# Altium schematic sheet top_power.SchDoc: Electrical Power System - General Block Diagram - Power
size A4; Date: 2015-08-29; Author: Piotr Kuligowski; Revision: 1-0; SheetTotal: 14; Model: EM1; PageSetup: Record=PageOptions|CenterHorizontal=True|CenterVertical=True|PrintScale=0.52|XCorrection=1.00|YCorrection=1.00|PrintKind=1|BorderSize=5000000|LeftOffset=0|BottomOffset=0|Orientation=2|PaperLength=4200|PaperWidth=2970|Scale=100|PaperSource=7|PrintQuality=600|MediaType=1|DitherType=10|PaperKind=A3|PrintScaleMode=1
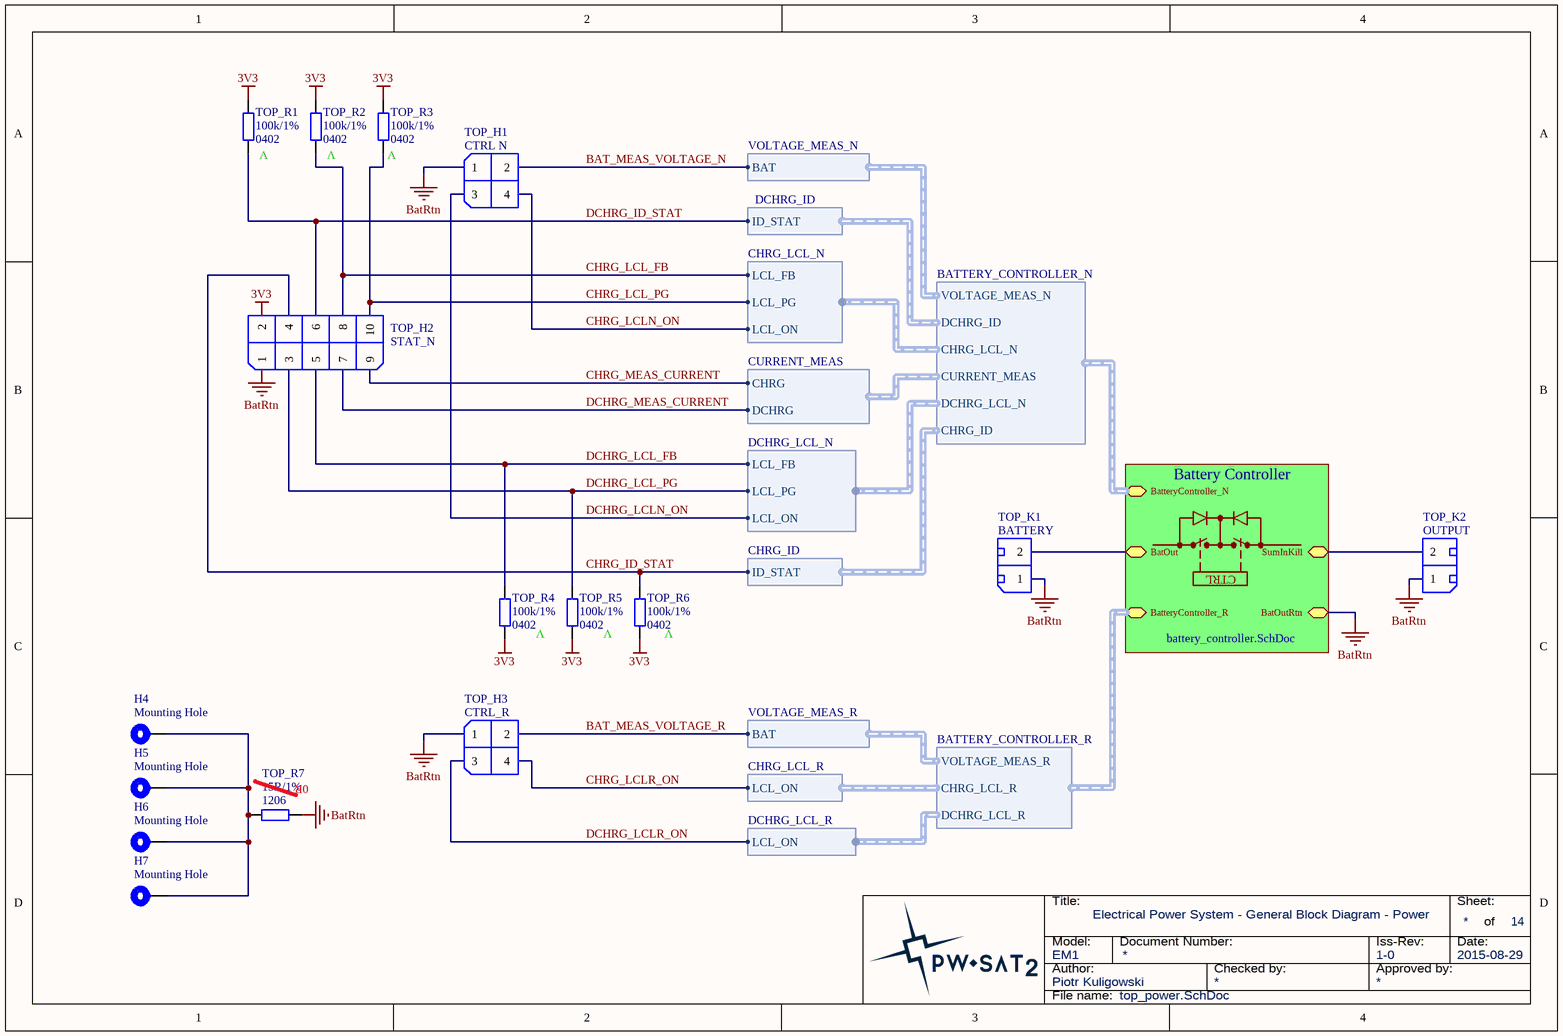
[diagram p0: top_power.SchDoc]

## Parts
H4  Mounting Hole  [PC-104_PcbMntHole_M3]
H5  Mounting Hole  [PC-104_PcbMntHole_M3]
H6  Mounting Hole  [PC-104_PcbMntHole_M3]
H7  Mounting Hole  [PC-104_PcbMntHole_M3]
TOP_H1  CTRL N  [Harwin_Datamate_L-Tek_M80-8670405]
TOP_H2  STAT_N  [Harwin_Datamate_L-Tek_M80-8671005]
TOP_H3  CTRL_R  [Harwin_Datamate_L-Tek_M80-8670405]
TOP_K1  ProviderPartNumber: BATTERY  [TerminalBlock_Spring_2.54_2-R]  (hidden comment: TB-2.5-PD-xx)
TOP_K2  ProviderPartNumber: OUTPUT  [TerminalBlock_Spring_2.54_2-R]  (hidden comment: TB-2.5-PD-xx)
TOP_R1  Package: 0402  [SMD_Resistor_0402]  (hidden comment: 100k/1%)
TOP_R2  Package: 0402  [SMD_Resistor_0402]  (hidden comment: 100k/1%)
TOP_R3  Package: 0402  [SMD_Resistor_0402]  (hidden comment: 100k/1%)
TOP_R4  Package: 0402  [SMD_Resistor_0402]  (hidden comment: 100k/1%)
TOP_R5  Package: 0402  [SMD_Resistor_0402]  (hidden comment: 100k/1%)
TOP_R6  Package: 0402  [SMD_Resistor_0402]  (hidden comment: 100k/1%)
TOP_R7  Package: 1206  [SMD_Resistor_1206]  (hidden comment: 15R/1%)

## Sub-sheets
Battery Controller = battery_controller.SchDoc: SumInKill, BatOut, BatOutRtn, BatteryController_N (harness BATTERY_CONTROLLER_N), BatteryController_R (harness BATTERY_CONTROLLER_R)

## Harnesses
BATTERY_CONTROLLER_N: DCHRG_ID, CHRG_LCL_N, CURRENT_MEAS, DCHRG_LCL_N, CHRG_ID, VOLTAGE_MEAS_N
VOLTAGE_MEAS_N: BAT
DCHRG_ID: ID_STAT
CHRG_LCL_N: LCL_FB, LCL_PG, LCL_ON
CURRENT_MEAS: CHRG, DCHRG
DCHRG_LCL_N: LCL_FB, LCL_PG, LCL_ON
CHRG_ID: ID_STAT
BATTERY_CONTROLLER_R: DCHRG_LCL_R, CHRG_LCL_R, VOLTAGE_MEAS_R
VOLTAGE_MEAS_R: BAT
CHRG_LCL_R: LCL_ON
DCHRG_LCL_R: LCL_ON

## Nets
3V3: TOP_H2.2 TOP_R1.1 TOP_R2.1 TOP_R3.1 TOP_R4.2 TOP_R5.2 TOP_R6.2
BatRtn: TOP_H1.1 TOP_H2.1 TOP_H3.1 TOP_K1.1 TOP_K2.1 TOP_R7.2 ; sheet Battery Controller/BatOutRtn
BAT_MEAS_VOLTAGE_N: TOP_H1.2 ; harness VOLTAGE_MEAS_N.BAT
BAT_MEAS_VOLTAGE_R: TOP_H3.2 ; harness VOLTAGE_MEAS_R.BAT
CHRG_ID_STAT: TOP_H2.4 TOP_R6.1 ; harness CHRG_ID.ID_STAT
CHRG_LCL_FB: TOP_H2.8 TOP_R2.2 ; harness CHRG_LCL_N.LCL_FB
CHRG_LCL_PG: TOP_H2.10 TOP_R3.2 ; harness CHRG_LCL_N.LCL_PG
CHRG_LCLN_ON: TOP_H1.4 ; harness CHRG_LCL_N.LCL_ON
CHRG_LCLR_ON: TOP_H3.4 ; harness CHRG_LCL_R.LCL_ON
CHRG_MEAS_CURRENT: TOP_H2.9 ; harness CURRENT_MEAS.CHRG
DCHRG_ID_STAT: TOP_H2.6 TOP_R1.2 ; harness DCHRG_ID.ID_STAT
DCHRG_LCL_FB: TOP_H2.5 TOP_R4.1 ; harness DCHRG_LCL_N.LCL_FB
DCHRG_LCL_PG: TOP_H2.3 TOP_R5.1 ; harness DCHRG_LCL_N.LCL_PG
DCHRG_LCLN_ON: TOP_H1.3 ; harness DCHRG_LCL_N.LCL_ON
DCHRG_LCLR_ON: TOP_H3.3 ; harness DCHRG_LCL_R.LCL_ON
DCHRG_MEAS_CURRENT: TOP_H2.7 ; harness CURRENT_MEAS.DCHRG
NetH4_1: H4.1 H5.1 H6.1 H7.1 TOP_R7.1
NetTOP_K1_2: TOP_K1.2 ; sheet Battery Controller/BatOut
NetTOP_K2_2: TOP_K2.2 ; sheet Battery Controller/SumInKill

## Notes on the sheet
- (near TOP_R1) V
- (near TOP_R2) V
- (near TOP_R3) V
- CTRL
- (near TOP_R5) V
- (near TOP_R6) V
- (near TOP_R7) 0R
- Title:
- Sheet:
- of
- Author:
- Model:
- Document Number:
- Checked by:
- Iss-Rev:
- Approved by:
- Date:
- File name:

## Library data of the parts
H4-H7 = MntHole: PCB Mounting Hole; Value: Mounting Hole
TOP_H1 TOP_H3 = Harwin_Datamate_L-Tek_2x2pin: Harwin DataMate L-Tek, 2mm pitch, 2x2pin.; Value: Harwin DataMate L-Tek 2x2pin
TOP_H2 = Harwin_Datamate_L-Tek_2x5pin: Harwin DataMate L-Tek, 2mm pitch, 2x5pin.; Value: Harwin DataMate L-Tek 2x5pin
TOP_K1 TOP_K2 = TerminalBlock_Spring_2.54_2-R: Terminal block with spring, 2-pin, 2.54mm pitch, right angle.; Provider: TME.eu; Value: TB-2.5-PD-xx
TOP_R1-TOP_R6 = CRCW0402100KFKxxxx: 100k/1% Vishay CRCW 0402 Resistor. 63mW, 100ppm, 50V.; Manufacturer: Vishay; Value: 100k/1%
TOP_R7 = CRCW120615R0FKxxxx: 15R/1% Vishay CRCW 1206 Resistor. 250mW, 100ppm, 200V.; ManufacturerPartNumber: CRCW120615R0FKxxxx; Manufacturer: Vishay; Value: 15R/1%